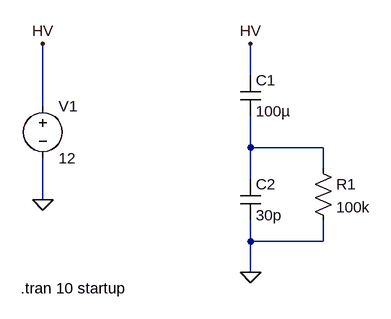
[diagram p0: schematic autoshutoff-LTspice.asc]
autoshutoff-LTspice.asc, the LTspice schematic file:
Version 4
SHEET 1 880 680
WIRE 192 48 192 0
WIRE -128 96 -128 0
WIRE 192 160 192 112
WIRE 304 160 192 160
WIRE 304 192 304 160
WIRE 192 208 192 160
WIRE -128 240 -128 176
WIRE 192 304 192 272
WIRE 304 304 304 272
WIRE 304 304 192 304
WIRE 192 352 192 304
FLAG 192 352 0
FLAG 192 0 HV
FLAG -128 240 0
FLAG -128 0 HV
SYMBOL cap 176 48 R0
SYMATTR InstName C1
SYMATTR Value 100µ
SYMBOL cap 176 208 R0
SYMATTR InstName C2
SYMATTR Value 30p
SYMBOL res 288 176 R0
SYMATTR InstName R1
SYMATTR Value 100k
SYMBOL voltage -128 80 R0
WINDOW 123 0 0 Left 2
WINDOW 39 0 0 Left 2
SYMATTR InstName V1
SYMATTR Value 12
TEXT -162 376 Left 2 !.tran 10 startup

The netlist it stands for:
* autoshutoff-LTspice.asc
C1 HV N001 100µ
C2 N001 0 30p
R1 N001 0 100k
V1 HV 0 12
.tran 10 startup
.backanno
.end